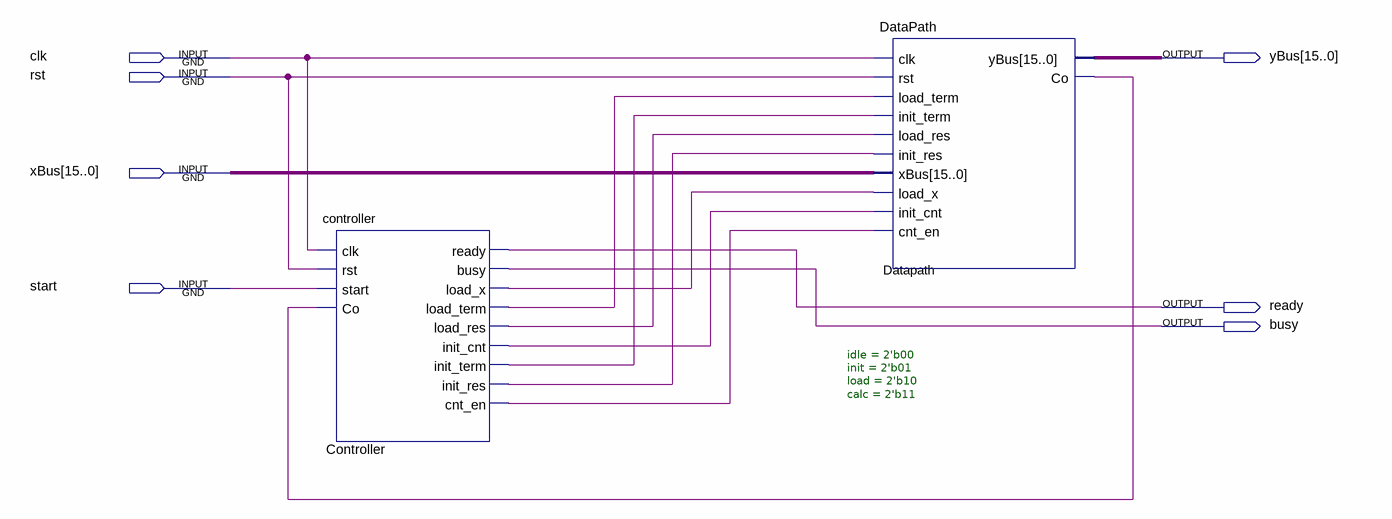
[diagram p0: schematic sheet]
// Quartus schematic TanAcc.bdf as structural Verilog: 2 symbols, 7 pins
module TanAcc (
  input  clk,
  input  rst,
  input  [15:0] xBus,
  input  start,
  output [15:0] yBus,
  output ready,
  output busy
);

  wire Controller_cnt_en, Controller_init_cnt, Controller_init_res, Controller_init_term,
       Controller_load_res, Controller_load_term, Controller_load_x, Datapath_co;

  controller #(.idle(2'b00), .init(2'b01), .load(2'b10), .calc(2'b11)) Controller (
    .clk(clk), .rst(rst), .start(start), .Co(Datapath_co), .ready(ready), .busy(busy),
    .load_x(Controller_load_x), .load_term(Controller_load_term), .load_res(Controller_load_res),
    .init_cnt(Controller_init_cnt), .init_term(Controller_init_term), .init_res(Controller_init_res),
    .cnt_en(Controller_cnt_en));
  DataPath Datapath (
    .clk(clk), .rst(rst), .load_term(Controller_load_term), .init_term(Controller_init_term),
    .load_res(Controller_load_res), .init_res(Controller_init_res), .xBus(xBus), .load_x(Controller_load_x),
    .init_cnt(Controller_init_cnt), .cnt_en(Controller_cnt_en), .yBus(yBus), .Co(Datapath_co));
endmodule
